# EAGLE design V_1 (EAGLE 9.5.2)
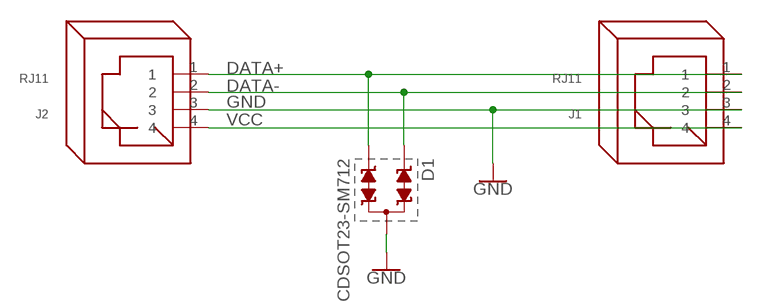
[diagram p0: schematic, sheet 1]

## Parts
D1  CDSOT23-SM712  [SOT23]
J1  RJ11  [RJ11]
J2  RJ11  [RJ11]

## Nets
DATA+: D1.2 J1.1 J2.1
DATA-: D1.1 J1.2 J2.2
GND: D1.3 J1.3 J2.3
VCC: J1.4 J2.4

## Library data of the parts
D1 = diode:CDSOT23-SM712: TVS DIODE
J1 J2 = con-rj:RJ11: RJ11, RJ22 RJ11 and RJ22 jacks side mounted http://www.tycoelectronics.com

## Board
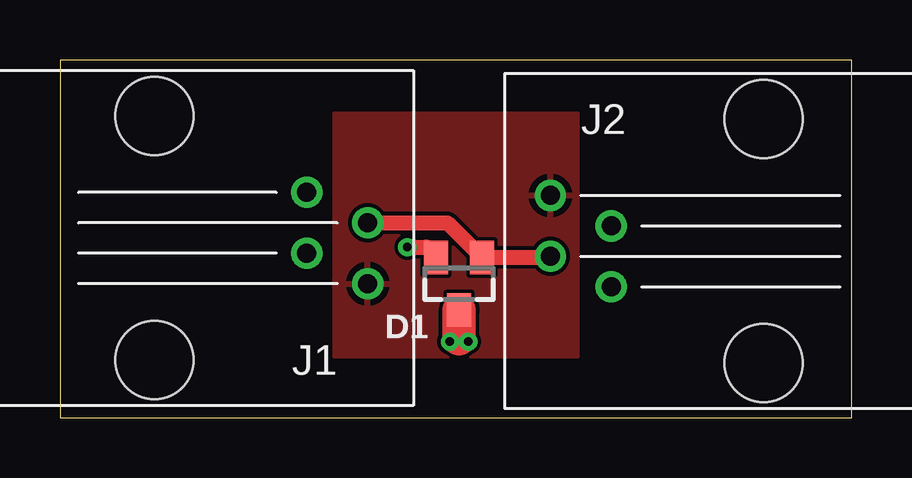
[diagram p1: board, top side]
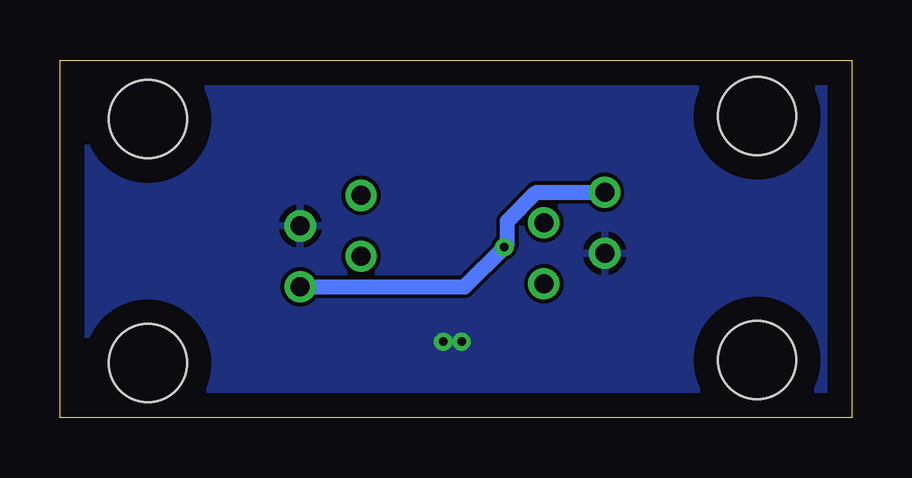
[diagram p2: board, bottom side, seen from below]

Size 33 x 14.91 mm. Coordinates in mm from the lower left corner, seen from the top.
Outline: 0,0 33,0 33,14.91 0,14.91 0,0
Copper layers (1*16): Top 0.035mm / dielectric 1.5mm / Bottom 0.035mm
Design rules "default *": minimum track width 6mil, minimum drill 0.35mm, track to track 6mil, track to pad 6mil, pad to pad 6mil, via to via 6mil, smd to smd 6mil, copper to edge 40mil, drill to drill 6mil, minimum pad ring 10mil, minimum via ring 8mil, stop-mask expansion 4mil, vias tented up to drill 0mil, thermal gap 10mil

### Footprints (pad centres in the part's own frame; a part is rotated, then mirrored left to right if it is on the bottom)
SOT23 = smd 1 x 1.4: 1 -0.95,-1.1; 2 0.95,-1.1; 3 0,1.1
RJ11 = drill 0.8: 1 -3.81,-2.54; 2 -6.35,-1.27; 3 -3.81,0; 4 -6.35,1.27 | hole 3.25: 2.54,-5.715; 2.54,4.445

### Placement (x,y rotation side)
D1  16.64,5.59 180 top
J1  6.48,6.86 180 top
J2  26.8,8 0 top

### Tracks (layer width: path | path; a pad name or v marks a point on that pad's centre or on a via)
DATA+  (via drill 0.35)
  Top 0.635: v14.48,7.11 15.26,7.11 D1.2
  Bottom 0.635: J2.1 16.13,5.46 v14.48,7.11 14.35,7.24 14.35,8.19 13.15,9.4 J1.1
DATA-
  Top 0.635: J1.2 16.15,8.13 D1.1 20.4,6.69 J2.2
GND  (via drill 0.35)
  Top 0.635: D1.3 17.02,4.11 v17.02,3.17
  Top 1.397: 16.64,3.3 D1.3
  other vias: 16.26,3.17
  pour Bottom: 0.51,14.35 32.26,14.35 32.26,0.38 0.76,0.38 0.38,0.38 0.38,14.35
VCC
  pour Top: 11.43,12.7 11.43,2.54 21.59,2.54 21.59,12.7